# Altium schematic sheet Vbat_key.SchDoc
size A4; SheetNumber: 16; SheetTotal: 21
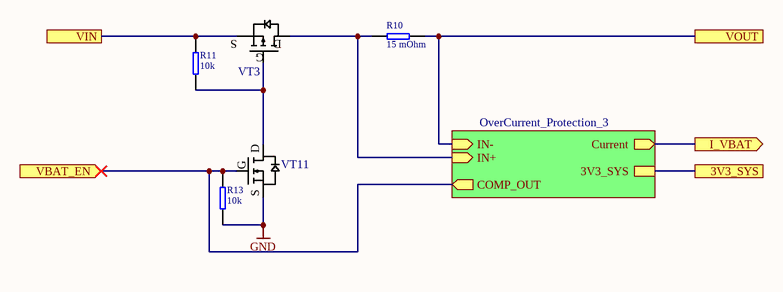
[diagram p0: Vbat_key.SchDoc]

## Parts
R10  value 15 mOhm  [RES 1210]
R11  value 10k  [RES 0402]
R13  value 10k  [RES 0402]
VT3  !Generic P MOSFET  [DFN-8_3x3]  (value not drawn)
VT11  2N7002  [SOT23-3]  (value not drawn)

## Sub-sheets
OverCurrent_Protection_3 = OverCurrent_Protection.SchDoc: IN- (in), IN+ (in), Current (out), COMP_OUT (out), 3V3_SYS

## Ports
3V3_SYS, I_VBAT (out), VBAT_EN (in), VIN, VOUT

## Nets
GND: R13.1 VT11.S1
3V3_SYS: port 3V3_SYS, sheet OverCurrent_Protection_3/3V3_SYS
I_VBAT: port I_VBAT, sheet OverCurrent_Protection_3/Current
VBAT_EN: R13.2 VT11.G2 ; port VBAT_EN, sheet OverCurrent_Protection_3/COMP_OUT
VIN: R11.2 VT3.S1 ; port VIN
VOUT: R10.2 ; port VOUT, sheet OverCurrent_Protection_3/IN-
NetR10_1: R10.1 VT3.D1 ; sheet OverCurrent_Protection_3/IN+
NetR11_1: R11.1 VT3.G2 VT11.D6

## Notes on the sheet
- (in symbol !Generic N MOSFET) D; G; S
- (in symbol !Generic P MOSFET) S; D; G

## Library data of the parts
R10 R11 R13 = !Resistor: Resistor; IsSMT: NoSMT
VT3 = !Generic P MOSFET: generic P mosfet; pin to pad: D1>5+6+7+8+TH G2>4 S1>1+2+3; IsSMT: NoSMT
VT11 = !Generic N MOSFET: generic N mosfet; pin to pad: D6>3 G2>1 S1>2; IsSMT: NoSMT